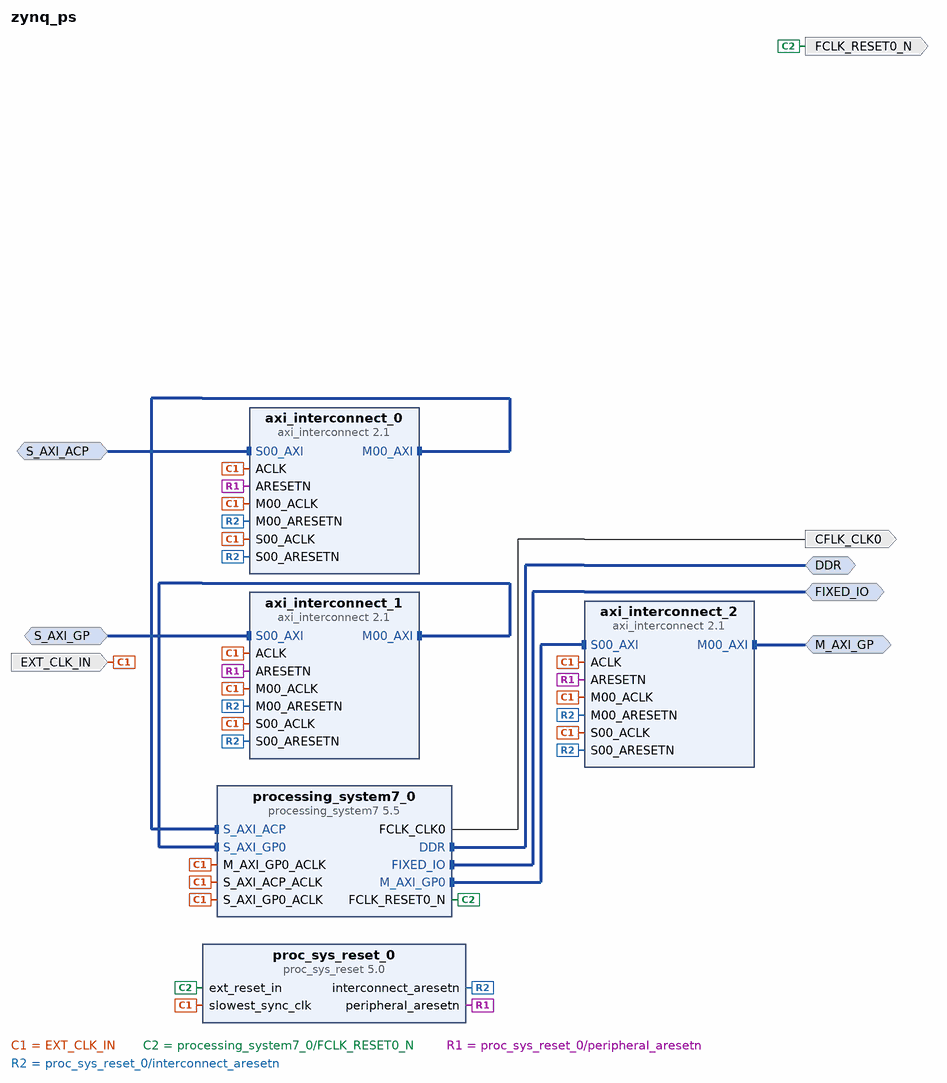
[diagram p0: block diagram of the top level]
# Vivado block design zynq_ps, xc7z020clg400-1, Vivado 2017.1
create_bd_design zynq_ps

create_bd_intf_port -mode Master -vlnv xilinx.com:interface:aximm_rtl:1.0 M_AXI_GP
set_property -dict {CONFIG.DATA_WIDTH 32 CONFIG.PROTOCOL AXI4 CONFIG.ADDR_WIDTH 32} [get_bd_intf_ports M_AXI_GP]
create_bd_intf_port -mode Master -vlnv xilinx.com:display_processing_system7:fixedio_rtl:1.0 FIXED_IO
create_bd_intf_port -mode Slave -vlnv xilinx.com:interface:aximm_rtl:1.0 S_AXI_ACP
set_property -dict [list \
  CONFIG.DATA_WIDTH 32 \
  CONFIG.PROTOCOL AXI4 \
  CONFIG.ID_WIDTH 0 \
  CONFIG.ADDR_WIDTH 32 \
  CONFIG.AWUSER_WIDTH 0 \
  CONFIG.ARUSER_WIDTH 0 \
  CONFIG.WUSER_WIDTH 0 \
  CONFIG.RUSER_WIDTH 0 \
  CONFIG.BUSER_WIDTH 0 \
  CONFIG.READ_WRITE_MODE READ_WRITE \
  CONFIG.HAS_BURST 1 \
  CONFIG.HAS_LOCK 1 \
  CONFIG.HAS_PROT 1 \
  CONFIG.HAS_CACHE 1 \
  CONFIG.HAS_QOS 1 \
  CONFIG.HAS_REGION 1 \
  CONFIG.HAS_WSTRB 1 \
  CONFIG.HAS_BRESP 1 \
  CONFIG.HAS_RRESP 1 \
  CONFIG.SUPPORTS_NARROW_BURST 1 \
  CONFIG.NUM_READ_OUTSTANDING 1 \
  CONFIG.NUM_WRITE_OUTSTANDING 1 \
  CONFIG.MAX_BURST_LENGTH 256 \
  CONFIG.NUM_READ_THREADS 1 \
  CONFIG.NUM_WRITE_THREADS 1 \
  CONFIG.RUSER_BITS_PER_BYTE 0 \
  CONFIG.WUSER_BITS_PER_BYTE 0 \
] [get_bd_intf_ports S_AXI_ACP]
create_bd_intf_port -mode Master -vlnv xilinx.com:interface:ddrx_rtl:1.0 DDR
create_bd_intf_port -mode Slave -vlnv xilinx.com:interface:aximm_rtl:1.0 S_AXI_GP
set_property -dict [list \
  CONFIG.DATA_WIDTH 32 \
  CONFIG.PROTOCOL AXI4 \
  CONFIG.ID_WIDTH 0 \
  CONFIG.ADDR_WIDTH 32 \
  CONFIG.AWUSER_WIDTH 0 \
  CONFIG.ARUSER_WIDTH 0 \
  CONFIG.WUSER_WIDTH 0 \
  CONFIG.RUSER_WIDTH 0 \
  CONFIG.BUSER_WIDTH 0 \
  CONFIG.READ_WRITE_MODE READ_WRITE \
  CONFIG.HAS_BURST 1 \
  CONFIG.HAS_LOCK 1 \
  CONFIG.HAS_PROT 1 \
  CONFIG.HAS_CACHE 1 \
  CONFIG.HAS_QOS 1 \
  CONFIG.HAS_REGION 1 \
  CONFIG.HAS_WSTRB 1 \
  CONFIG.HAS_BRESP 1 \
  CONFIG.HAS_RRESP 1 \
  CONFIG.SUPPORTS_NARROW_BURST 1 \
  CONFIG.NUM_READ_OUTSTANDING 1 \
  CONFIG.NUM_WRITE_OUTSTANDING 1 \
  CONFIG.MAX_BURST_LENGTH 256 \
  CONFIG.NUM_READ_THREADS 1 \
  CONFIG.NUM_WRITE_THREADS 1 \
  CONFIG.RUSER_BITS_PER_BYTE 0 \
  CONFIG.WUSER_BITS_PER_BYTE 0 \
] [get_bd_intf_ports S_AXI_GP]
create_bd_port -dir I -type clk EXT_CLK_IN
create_bd_port -dir O -type rst FCLK_RESET0_N
create_bd_port -dir O -type clk CFLK_CLK0

create_bd_cell -type ip -vlnv xilinx.com:ip:processing_system7:5.5 processing_system7_0
set_property -dict [list \
  CONFIG.PCW_SDIO_PERIPHERAL_FREQMHZ 50 \
  CONFIG.PCW_USE_S_AXI_GP0 1 \
  CONFIG.PCW_USE_S_AXI_ACP 1 \
  CONFIG.PCW_PRESET_BANK1_VOLTAGE {LVCMOS 1.8V} \
  CONFIG.PCW_UIPARAM_DDR_PARTNO {MT41K256M16 RE-125} \
  CONFIG.PCW_QSPI_PERIPHERAL_ENABLE 1 \
  CONFIG.PCW_QSPI_GRP_SINGLE_SS_ENABLE 1 \
  CONFIG.PCW_ENET0_PERIPHERAL_ENABLE 0 \
  CONFIG.PCW_SD0_PERIPHERAL_ENABLE 1 \
  CONFIG.PCW_SD0_GRP_CD_ENABLE 1 \
  CONFIG.PCW_SD0_GRP_CD_IO {MIO 46} \
  CONFIG.PCW_SD0_GRP_WP_ENABLE 1 \
  CONFIG.PCW_SD0_GRP_WP_IO {MIO 47} \
  CONFIG.PCW_UART1_PERIPHERAL_ENABLE 1 \
  CONFIG.PCW_USB0_PERIPHERAL_ENABLE 0 \
  CONFIG.PCW_GPIO_MIO_GPIO_ENABLE 0 \
] [get_bd_cells processing_system7_0]
# 20 more settings of processing_system7_0 are not shown: defaults, MIO pin electricals, DDR timing, and values the tool derives
create_bd_cell -type ip -vlnv xilinx.com:ip:proc_sys_reset:5.0 proc_sys_reset_0
create_bd_cell -type ip -vlnv xilinx.com:ip:axi_interconnect:2.1 axi_interconnect_0
set_property -dict {CONFIG.NUM_MI 1} [get_bd_cells axi_interconnect_0]
create_bd_cell -type ip -vlnv xilinx.com:ip:axi_interconnect:2.1 axi_interconnect_1
set_property -dict {CONFIG.NUM_MI 1} [get_bd_cells axi_interconnect_1]
create_bd_cell -type ip -vlnv xilinx.com:ip:axi_interconnect:2.1 axi_interconnect_2
set_property -dict {CONFIG.NUM_MI 1} [get_bd_cells axi_interconnect_2]

# ---- connections ----

connect_bd_intf_net [get_bd_intf_pins axi_interconnect_0/M00_AXI] [get_bd_intf_pins processing_system7_0/S_AXI_ACP]
connect_bd_intf_net [get_bd_intf_pins axi_interconnect_1/M00_AXI] [get_bd_intf_pins processing_system7_0/S_AXI_GP0]
connect_bd_intf_net [get_bd_intf_pins processing_system7_0/M_AXI_GP0] [get_bd_intf_pins axi_interconnect_2/S00_AXI]
connect_bd_intf_net [get_bd_intf_ports M_AXI_GP] [get_bd_intf_pins axi_interconnect_2/M00_AXI]
connect_bd_intf_net [get_bd_intf_ports FIXED_IO] [get_bd_intf_pins processing_system7_0/FIXED_IO]
connect_bd_intf_net [get_bd_intf_ports S_AXI_ACP] [get_bd_intf_pins axi_interconnect_0/S00_AXI]
connect_bd_intf_net [get_bd_intf_ports DDR] [get_bd_intf_pins processing_system7_0/DDR]
connect_bd_intf_net [get_bd_intf_ports S_AXI_GP] [get_bd_intf_pins axi_interconnect_1/S00_AXI]
connect_bd_net [get_bd_ports EXT_CLK_IN] \
  [get_bd_pins proc_sys_reset_0/slowest_sync_clk] [get_bd_pins processing_system7_0/M_AXI_GP0_ACLK] \
  [get_bd_pins processing_system7_0/S_AXI_GP0_ACLK] [get_bd_pins processing_system7_0/S_AXI_ACP_ACLK] \
  [get_bd_pins axi_interconnect_2/ACLK] [get_bd_pins axi_interconnect_2/S00_ACLK] [get_bd_pins axi_interconnect_2/M00_ACLK] \
  [get_bd_pins axi_interconnect_0/ACLK] [get_bd_pins axi_interconnect_0/S00_ACLK] [get_bd_pins axi_interconnect_0/M00_ACLK] \
  [get_bd_pins axi_interconnect_1/M00_ACLK] [get_bd_pins axi_interconnect_1/S00_ACLK] [get_bd_pins axi_interconnect_1/ACLK]
connect_bd_net [get_bd_pins processing_system7_0/FCLK_RESET0_N] [get_bd_ports FCLK_RESET0_N] [get_bd_pins proc_sys_reset_0/ext_reset_in]
connect_bd_net [get_bd_pins processing_system7_0/FCLK_CLK0] [get_bd_ports CFLK_CLK0]
connect_bd_net [get_bd_pins proc_sys_reset_0/peripheral_aresetn] \
  [get_bd_pins axi_interconnect_0/ARESETN] [get_bd_pins axi_interconnect_1/ARESETN] [get_bd_pins axi_interconnect_2/ARESETN]
connect_bd_net [get_bd_pins proc_sys_reset_0/interconnect_aresetn] \
  [get_bd_pins axi_interconnect_0/S00_ARESETN] [get_bd_pins axi_interconnect_0/M00_ARESETN] \
  [get_bd_pins axi_interconnect_1/S00_ARESETN] [get_bd_pins axi_interconnect_1/M00_ARESETN] \
  [get_bd_pins axi_interconnect_2/M00_ARESETN] [get_bd_pins axi_interconnect_2/S00_ARESETN]

# ---- address map ----
assign_bd_address -offset 0x43C00000 -range 64K -target_address_space [get_bd_addr_spaces processing_system7_0/Data] [get_bd_addr_segs M_AXI_GP/Reg]
assign_bd_address -offset 0x00000000 -range 256M -target_address_space [get_bd_addr_spaces S_AXI_ACP] [get_bd_addr_segs processing_system7_0/S_AXI_ACP/ACP_DDR_LOWOCM]
assign_bd_address -offset 0x40000000 -range 256M -target_address_space [get_bd_addr_spaces S_AXI_ACP] [get_bd_addr_segs processing_system7_0/S_AXI_ACP/ACP_M_AXI_GP0]
assign_bd_address -offset 0xE0000000 -range 4M -target_address_space [get_bd_addr_spaces S_AXI_ACP] [get_bd_addr_segs processing_system7_0/S_AXI_ACP/ACP_IOP]
assign_bd_address -offset 0xFC000000 -range 16M -target_address_space [get_bd_addr_spaces S_AXI_ACP] [get_bd_addr_segs processing_system7_0/S_AXI_ACP/ACP_QSPI_LINEAR]
assign_bd_address -offset 0x00000000 -range 256M -target_address_space [get_bd_addr_spaces S_AXI_GP] [get_bd_addr_segs processing_system7_0/S_AXI_GP0/GP0_DDR_LOWOCM]
assign_bd_address -offset 0x40000000 -range 256M -target_address_space [get_bd_addr_spaces S_AXI_GP] [get_bd_addr_segs processing_system7_0/S_AXI_GP0/GP0_M_AXI_GP0]
assign_bd_address -offset 0xE0000000 -range 4M -target_address_space [get_bd_addr_spaces S_AXI_GP] [get_bd_addr_segs processing_system7_0/S_AXI_GP0/GP0_IOP]
assign_bd_address -offset 0xFC000000 -range 16M -target_address_space [get_bd_addr_spaces S_AXI_GP] [get_bd_addr_segs processing_system7_0/S_AXI_GP0/GP0_QSPI_LINEAR]

validate_bd_design
save_bd_design
